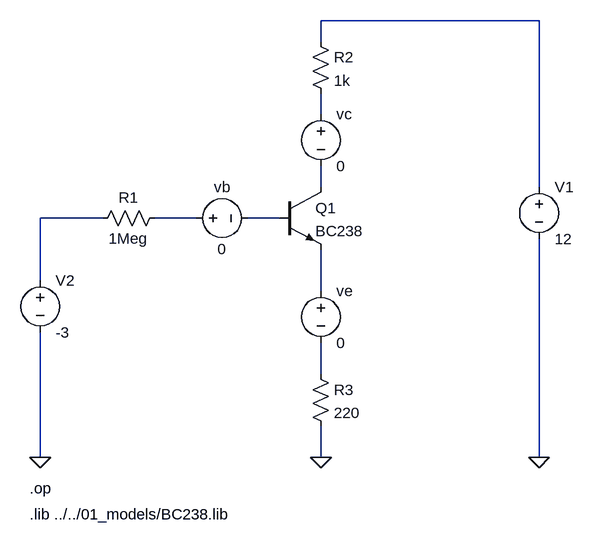
[diagram p0: schematic bjtchar_03_02_02_cutoff.asc]
bjtchar_03_02_02_cutoff.asc, the LTspice schematic file:
Version 4
SHEET 1 880 680
WIRE 576 -144 240 -144
WIRE 240 -112 240 -144
WIRE 240 0 240 -32
WIRE 240 112 240 80
WIRE 576 112 576 -144
WIRE -96 160 -192 160
WIRE 48 160 -16 160
WIRE 176 160 128 160
WIRE -192 256 -192 160
WIRE 240 272 240 208
WIRE 240 400 240 352
WIRE -192 528 -192 336
WIRE 240 528 240 480
WIRE 576 528 576 192
FLAG 576 528 0
FLAG 240 528 0
FLAG -192 528 0
SYMBOL npn 176 112 R0
SYMATTR InstName Q1
SYMATTR Value BC238
SYMBOL voltage 576 96 R0
WINDOW 123 0 0 Left 2
WINDOW 39 0 0 Left 2
SYMATTR InstName V1
SYMATTR Value 12
SYMBOL voltage -192 240 R0
WINDOW 123 0 0 Left 2
WINDOW 39 0 0 Left 2
SYMATTR InstName V2
SYMATTR Value -3
SYMBOL res 0 144 R90
WINDOW 0 0 56 VBottom 2
WINDOW 3 32 56 VTop 2
SYMATTR InstName R1
SYMATTR Value 1Meg
SYMBOL res 224 -128 R0
SYMATTR InstName R2
SYMATTR Value 1k
SYMBOL res 224 384 R0
SYMATTR InstName R3
SYMATTR Value 220
SYMBOL voltage 240 -16 R0
WINDOW 123 0 0 Left 2
WINDOW 39 0 0 Left 2
SYMATTR InstName vc
SYMATTR Value 0
SYMBOL voltage 240 256 R0
WINDOW 123 0 0 Left 2
WINDOW 39 0 0 Left 2
SYMATTR InstName ve
SYMATTR Value 0
SYMBOL voltage 32 160 M90
WINDOW 0 -32 56 VBottom 2
WINDOW 3 32 56 VTop 2
WINDOW 123 0 0 Left 2
WINDOW 39 0 0 Left 2
SYMATTR InstName vb
SYMATTR Value 0
TEXT -208 576 Left 2 !.op
TEXT -208 616 Left 2 !.lib ../../01_models/BC238.lib

The netlist it stands for:
* bjtchar_03_02_02_cutoff.asc
Q1 N003 N006 N007 0 BC238
V1 N001 0 12
V2 N004 0 -3
R1 N005 N004 1Meg
R2 N001 N002 1k
R3 N008 0 220
vc N002 N003 0
ve N007 N008 0
vb N005 N006 0
.model NPN NPN
.model PNP PNP
.lib standard.bjt
.op
.lib ../../01_models/BC238.lib
.backanno
.end